# Altium schematic sheet LM7310.SchDoc
size A; SheetNumber: 8; SheetTotal: 11
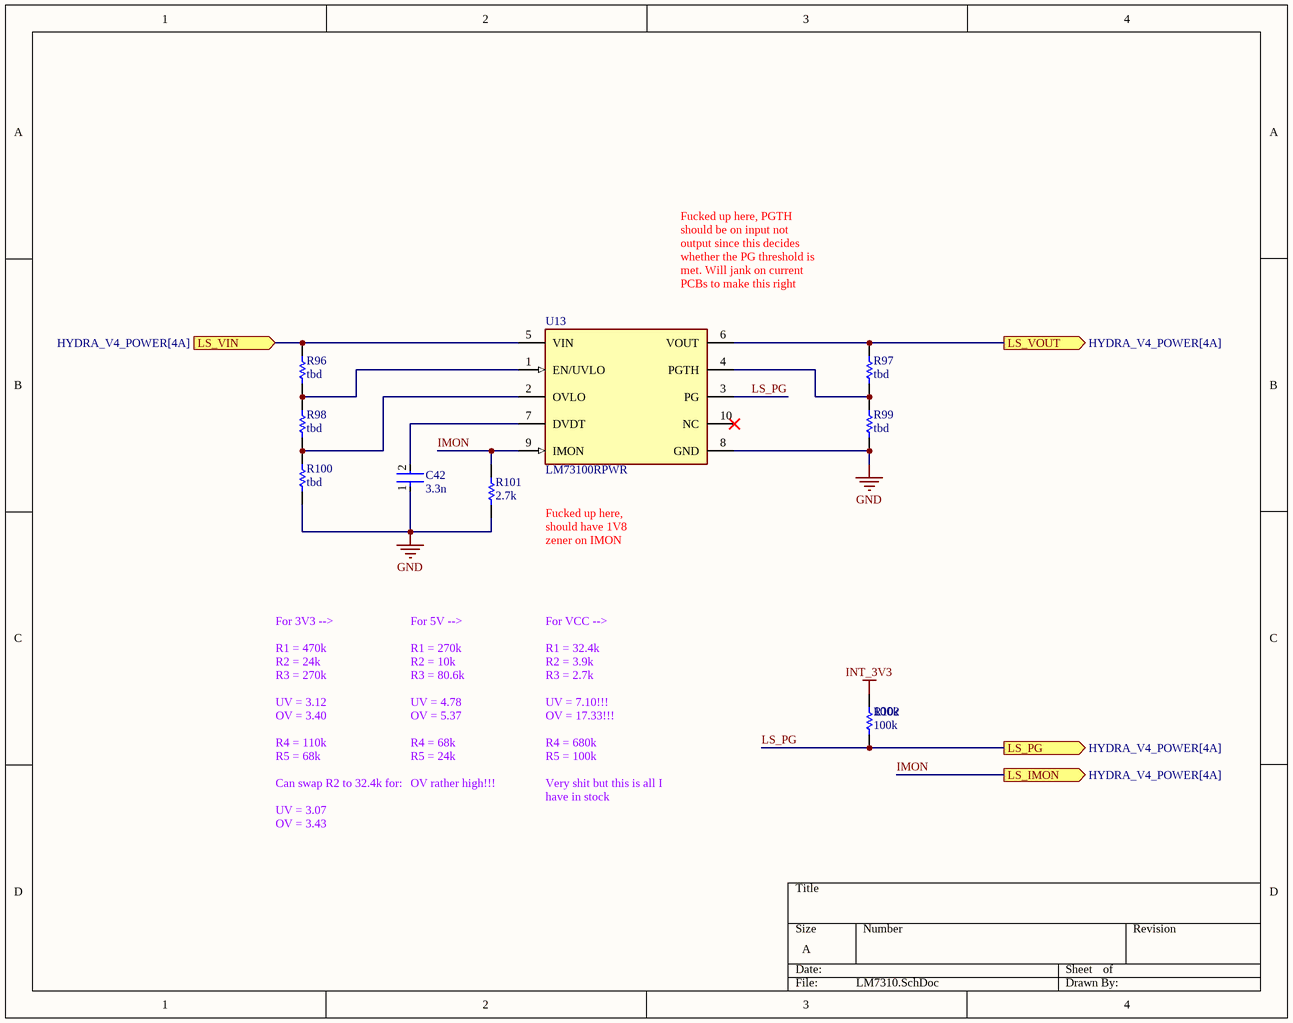
[diagram p0: LM7310.SchDoc]

## Parts
C42  3.3n  [FP-0402-L_1_0_0_05-W_0_5-IPC_A]
R96  tbd  [R0603B]
R97  tbd  [R0603B]
R98  tbd  [R0603B]
R99  tbd  [R0603B]
R100  tbd  [R0603B]
R101  2.7k  [R0603B]
R102  100k  [R0603B]
U13  LM73100RPWR  [FP-RPW0010A-MFG]

## Ports
LS_IMON (out, see HYDRA_V4_POWER[4A]), LS_PG (out, see HYDRA_V4_POWER[4A]), LS_VIN (in, see HYDRA_V4_POWER[4A]), LS_VOUT (out, see HYDRA_V4_POWER[4A])

## Nets
GND: C42.1 R99.1 R100.1 R101.1 U13.8(GND)
INT_3V3: R102.2
IMON: R101.2 U13.9(IMON) ; port LS_IMON
LS_PG: R102.1 U13.3(PG) ; port LS_PG
LS_VIN: R96.2 U13.5(VIN) ; port LS_VIN
LS_VOUT: R97.2 U13.6(VOUT) ; port LS_VOUT
NetC42_2: C42.2 U13.7(DVDT)
NetR96_1: R96.1 R98.2 U13.1(EN/UVLO)
NetR97_1: R97.1 R99.2 U13.4(PGTH)
NetR98_1: R98.1 R100.2 U13.2(OVLO)

Not connected (* = marked no-connect by the designer): U13 10(NC)*

## Notes on the sheet
- Fucked up here, PGTH should be on input not output since this decides whether the PG threshold is met. Will jank on current PCBs to make this right
- Fucked up here, should have 1V8 zener on IMON
- For 3V3 -->
  R1 = 470k
  R2 = 24k
  R3 = 270k
  UV = 3.12
  OV = 3.40
  R4 = 110k
  R5 = 68k
  Can swap R2 to 32.4k for:
  UV = 3.07
  OV = 3.43
- For 5V -->
  R1 = 270k
  R2 = 10k
  R3 = 80.6k
  UV = 4.78
  OV = 5.37
  R4 = 68k
  R5 = 24k
  OV rather high!!!
- For VCC -->
  R1 = 32.4k
  R2 = 3.9k
  R3 = 2.7k
  UV = 7.10!!!
  OV = 17.33!!!
  R4 = 680k
  R5 = 100k
  Very shit but this is all I have in stock

## Library data of the parts
C42 = CMP-001-00058-1: LARGE PADS, 0402 CAP, CHANGE COMMENT TO MATCH REAL P/N; Capacitor Type: Ceramic; Value: 3.3n; Min Operating Temperature: -55°C; Mounting Technology: Surface Mount; Pins: 2; Case/Package: 0402; RoHS Compliant: Yes; Max Operating Temperature: 85°C
R96-R100 R102 = CMP-009-00002-14: Resistor
  R96-R100: Value: tbd
  R102: Value: 100k
R101 = CMP-009-00002-14: Resistor; Value: tbd
U13 = CMP-04910-000122-1: 2.7-V TO 23-V, 5.5-A IDEAL DIODE; RoHS Compliant: Yes